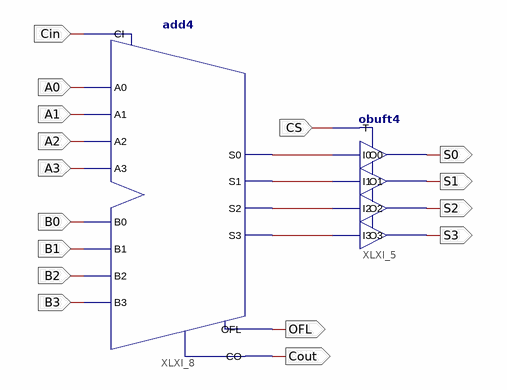
[diagram p0: schematic sheet 1]
// Xilinx ISE schematic AdderX4.sch (spartan3e) as structural Verilog: 2 symbols, 16 ports
module AdderX4 (
  input  CS,
  input  Cin,
  input  A0,
  input  A1,
  input  A2,
  input  A3,
  input  B0,
  input  B1,
  input  B2,
  input  B3,
  output S0,
  output S1,
  output S2,
  output S3,
  output Cout,
  output OFL
);

  wire XLXN_50, XLXN_51, XLXN_52, XLXN_53;

  obuft4 XLXI_5 (.I0(XLXN_50), .I1(XLXN_51), .I2(XLXN_52), .I3(XLXN_53), .T(CS), .O0(S0), .O1(S1), .O2(S2), .O3(S3));
  add4 XLXI_8 (
    .A0(A0), .A1(A1), .A2(A2), .A3(A3), .B0(B0), .B1(B1), .B2(B2), .B3(B3), .CI(Cin), .CO(Cout), .OFL(OFL),
    .S0(XLXN_50), .S1(XLXN_51), .S2(XLXN_52), .S3(XLXN_53));
endmodule
